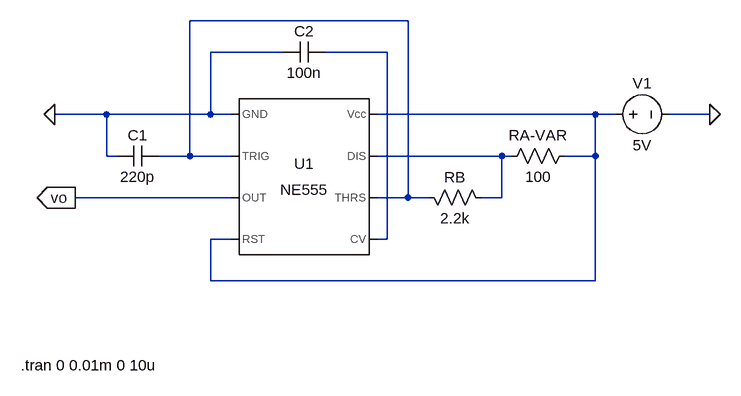
[diagram p0: schematic 555.asc]
555.asc, the LTspice schematic file:
Version 4
SHEET 1 880 680
WIRE 336 -80 0 -80
WIRE 144 -32 32 -32
WIRE 304 -32 208 -32
WIRE -128 64 -208 64
WIRE 32 64 32 -32
WIRE 32 64 -128 64
WIRE 64 64 32 64
WIRE 624 64 288 64
WIRE 656 64 624 64
WIRE 800 64 736 64
WIRE -128 128 -128 64
WIRE -112 128 -128 128
WIRE 0 128 0 -80
WIRE 0 128 -48 128
WIRE 64 128 0 128
WIRE 480 128 288 128
WIRE 496 128 480 128
WIRE 624 128 624 64
WIRE 624 128 576 128
WIRE 64 192 -176 192
WIRE 336 192 336 -80
WIRE 336 192 288 192
WIRE 368 192 336 192
WIRE 480 192 480 128
WIRE 480 192 448 192
WIRE 64 256 32 256
WIRE 304 256 304 -32
WIRE 304 256 288 256
WIRE 32 320 32 256
WIRE 624 320 624 128
WIRE 624 320 32 320
FLAG -208 64 0
FLAG 800 64 0
FLAG -176 192 vo
IOPIN -176 192 Out
SYMBOL Misc\\NE555 176 160 R0
SYMATTR InstName U1
SYMBOL voltage 640 64 R270
WINDOW 0 32 56 VTop 2
WINDOW 3 -32 56 VBottom 2
WINDOW 123 0 0 Left 0
WINDOW 39 0 0 Left 0
SYMATTR InstName V1
SYMATTR Value 5V
SYMBOL cap -48 112 R90
WINDOW 0 0 32 VBottom 2
WINDOW 3 32 32 VTop 2
SYMATTR InstName C1
SYMATTR Value 220p
SYMBOL cap 208 -48 R90
WINDOW 0 0 32 VBottom 2
WINDOW 3 32 32 VTop 2
SYMATTR InstName C2
SYMATTR Value 100n
SYMBOL res 352 176 M90
WINDOW 0 0 56 VBottom 2
WINDOW 3 32 56 VTop 2
SYMATTR InstName RB
SYMATTR Value 2.2k
SYMBOL res 592 112 R90
WINDOW 0 0 56 VBottom 2
WINDOW 3 32 56 VTop 2
SYMATTR InstName RA-VAR
SYMATTR Value 100
TEXT -260 450 Left 2 !.tran 0 0.01m 0 10u

The netlist it stands for:
* 555.asc
XU1 0 N001 vo N003 N002 N001 N004 N003 NE555  ; pins GND TRIG OUT RST CV THRS DIS Vcc
V1 N003 0 5V
C1 N001 0 220p
C2 N002 0 100n
RB N001 N004 2.2k
RA-VAR N003 N004 100
.tran 0 0.01m 0 10u
.lib NE555.sub
.backanno
.end